# EAGLE design SHIELD TFT (EAGLE 9.6.2)
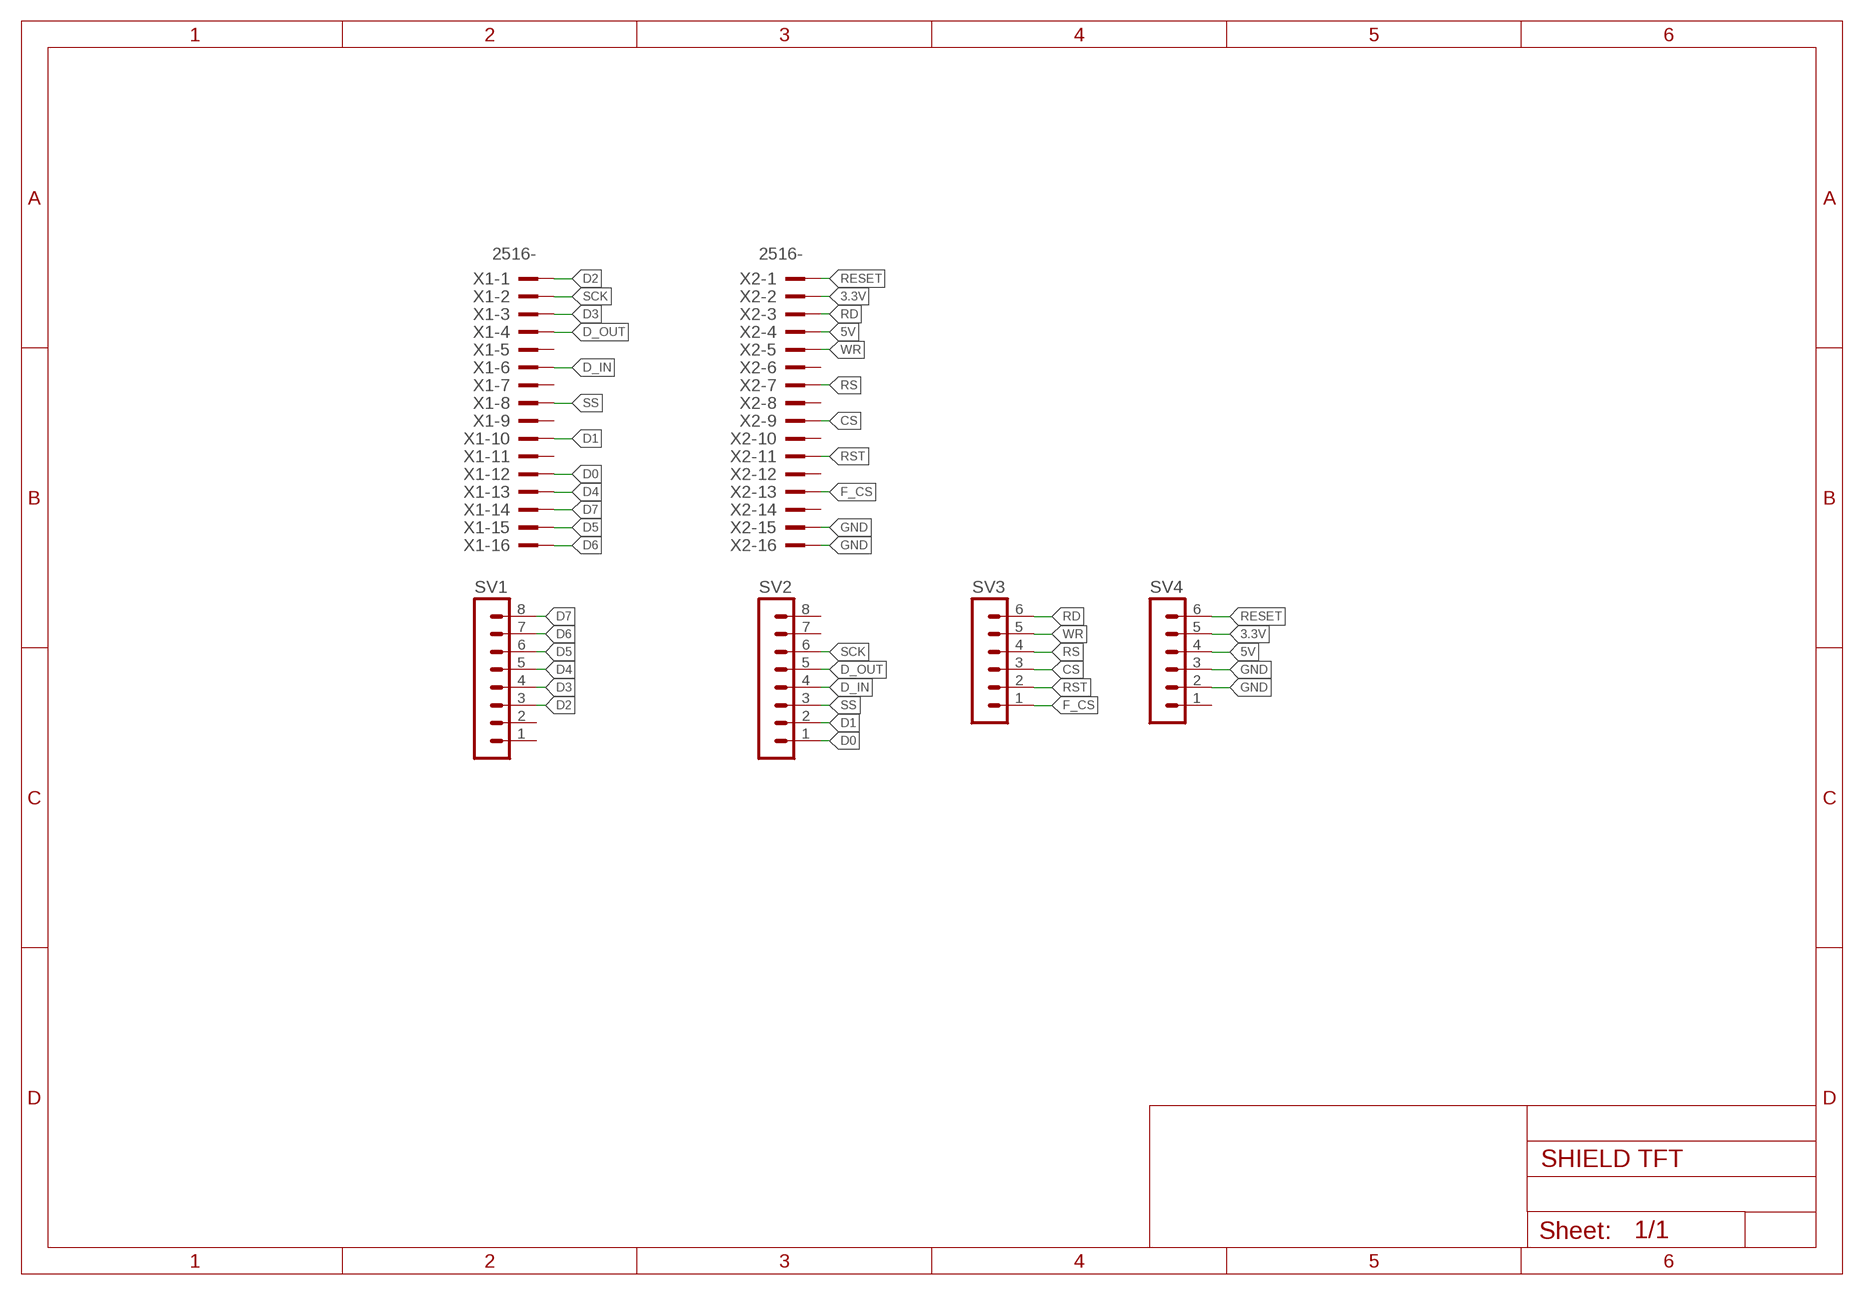
[diagram p0: schematic, sheet 1]

## Parts
SV1  MA08-1  [MA08-1]
SV2  MA08-1  [MA08-1]
SV3  MA06-1  [MA06-1]
SV4  MA06-1  [MA06-1]
X1  2516-  [PAK100/2500-16]
X2  2516-  [PAK100/2500-16]

## Nets
3.3V: SV4.5 X2.2
5V: SV4.4 X2.4
CS: SV3.3 X2.9
D0: SV2.1 X1.12
D1: SV2.2 X1.10
D2: SV1.3 X1.1
D3: SV1.4 X1.3
D4: SV1.5 X1.13
D5: SV1.6 X1.15
D6: SV1.7 X1.16
D7: SV1.8 X1.14
D_IN: SV2.4 X1.6
D_OUT: SV2.5 X1.4
F_CS: SV3.1 X2.13
GND: SV4.2 SV4.3 X2.15 X2.16
RD: SV3.6 X2.3
RESET: SV4.6 X2.1
RS: SV3.4 X2.7
RST: SV3.2 X2.11
SCK: SV2.6 X1.2
SS: SV2.3 X1.8
WR: SV3.5 X2.5
Unconnected: SV1.1 SV1.2 SV2.7 SV2.8 SV4.1 X1.5 X1.7 X1.9 X1.11 X2.6 X2.8 X2.10 X2.12 X2.14

## Library data of the parts
SV1 SV2 = con-lstb:MA08-1: PIN HEADER; OC_FARNELL: unknown; OC_NEWARK: unknown
SV3 SV4 = con-lstb:MA06-1: PIN HEADER; OC_FARNELL: unknown; OC_NEWARK: unknown
X1 X2 = con-3m:2516-: 3M (TM) Pak 100 4-Wall Header Source: 3M; OC_FARNELL: unknown; OC_NEWARK: unknown

## Board
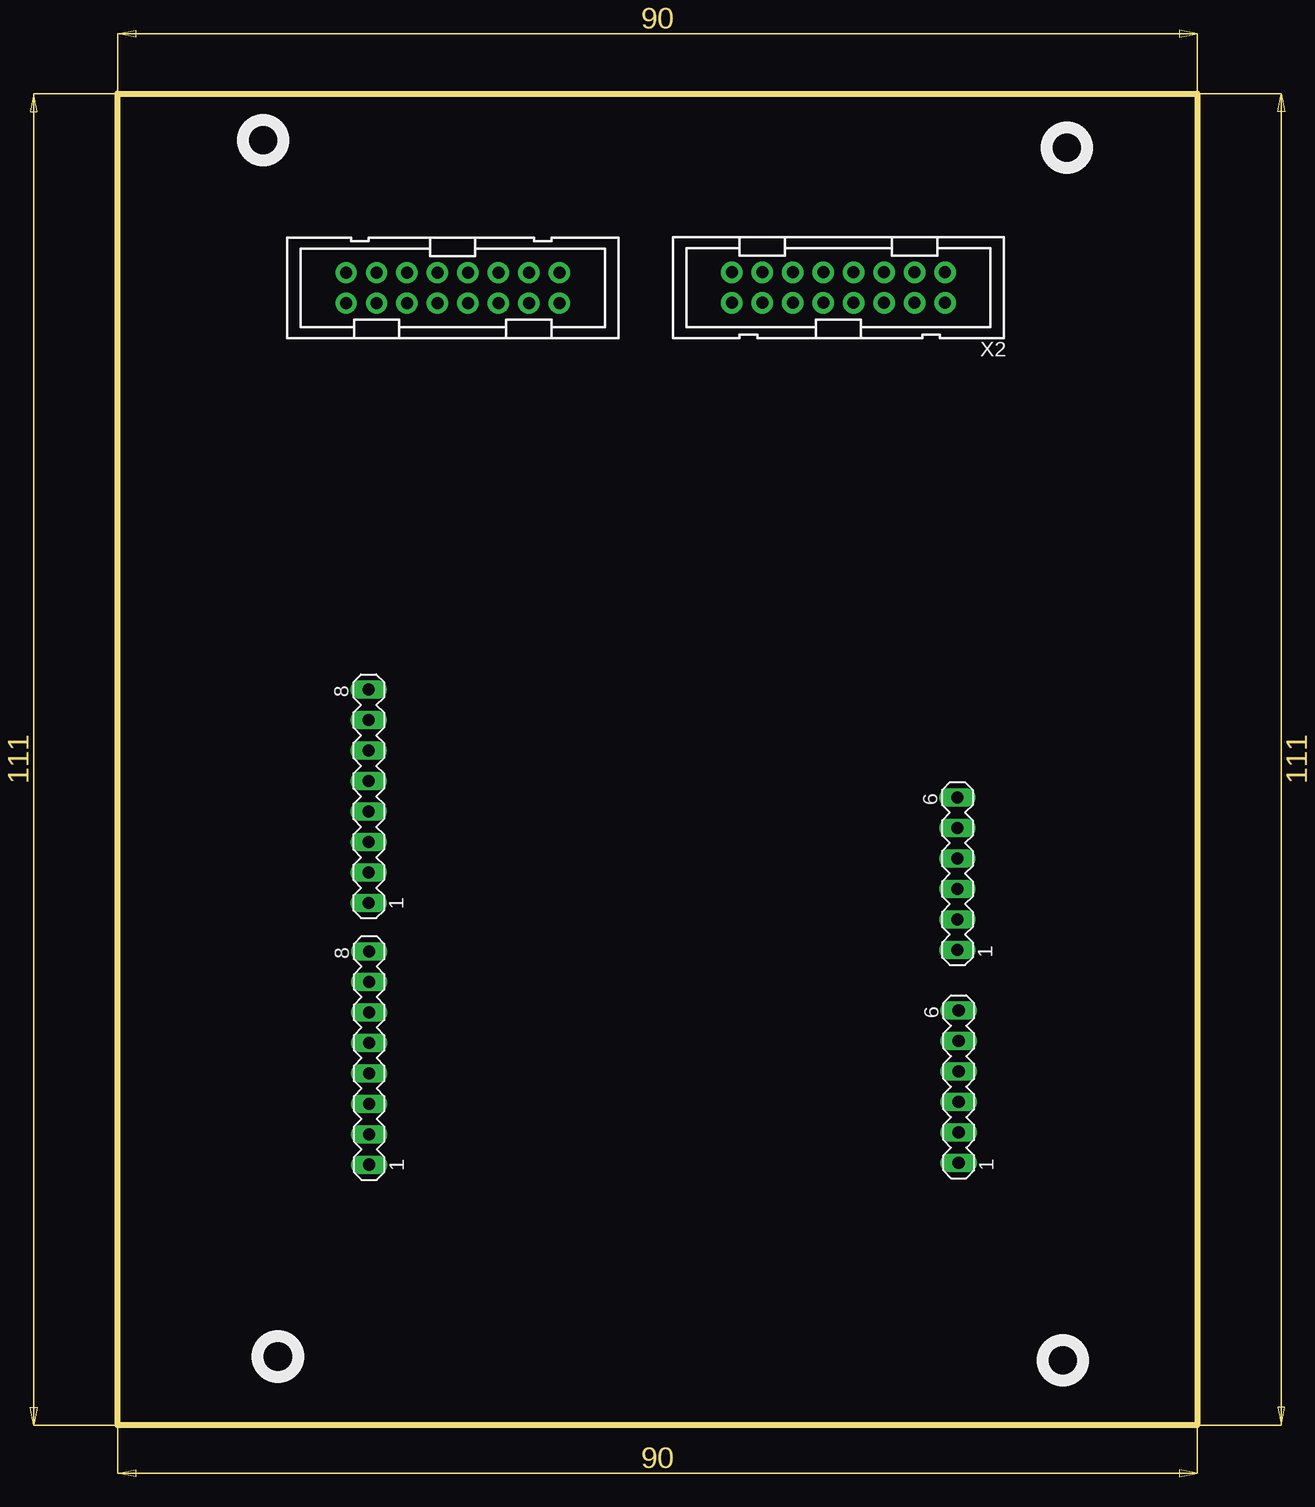
[diagram p1: board, top side]
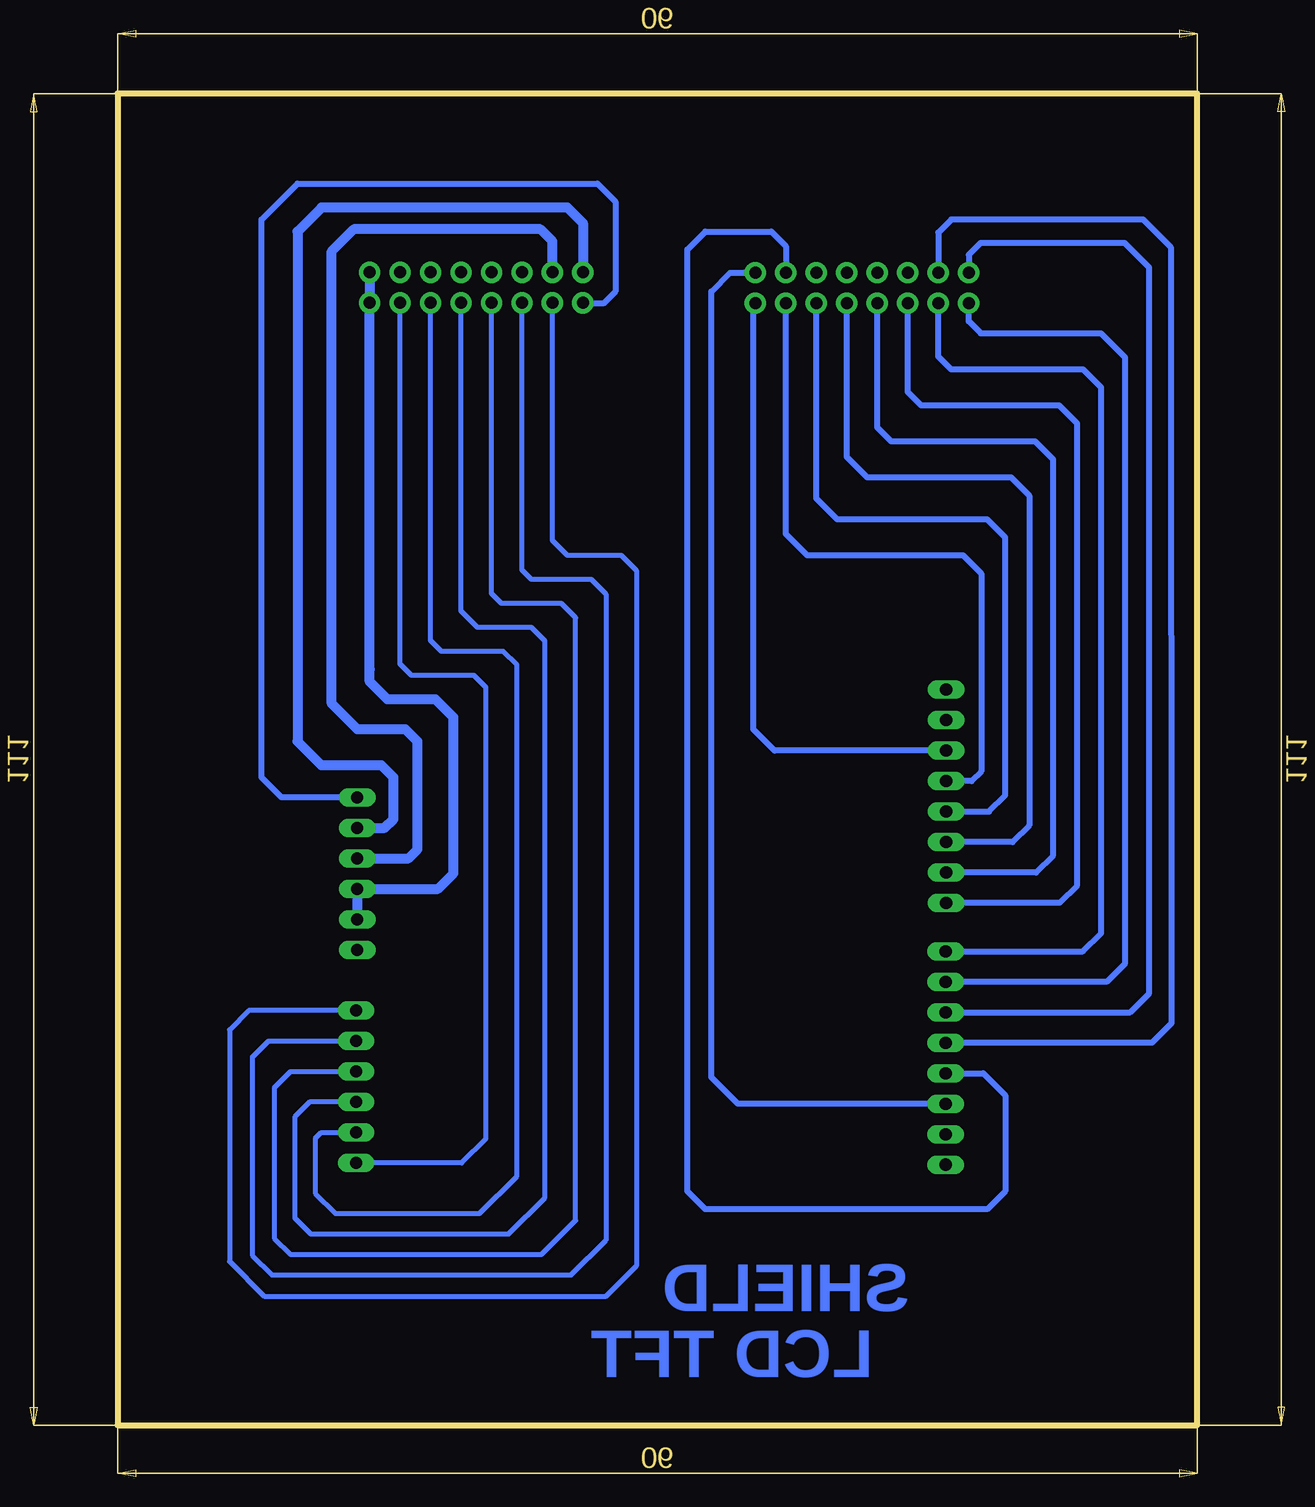
[diagram p2: board, bottom side, seen from below]

Size 90 x 111 mm. Coordinates in mm from the lower left corner, seen from the top.
Outline: 0,111 90,111 90,0 0,0 0,111
Copper layers (1*16): Top 0.035mm / dielectric 1.5mm / Bottom 0.035mm
Design rules "default *": minimum track width 6mil, minimum drill 0.35mm, track to track 12mil, track to pad 12mil, pad to pad 12mil, via to via 24mil, smd to smd 6mil, copper to edge 40mil, drill to drill 6mil, minimum pad ring 10mil, minimum via ring 8mil, stop-mask expansion 4mil, vias tented up to drill 0mil, thermal gap 10mil

### Footprints (pad centres in the part's own frame; a part is rotated, then mirrored left to right if it is on the bottom)
MA08-1 = drill 1.016 long: 1 -8.89,0; 2 -6.35,0; 3 -3.81,0; 4 -1.27,0; 5 1.27,0; 6 3.81,0; 7 6.35,0; 8 8.89,0
MA06-1 = drill 1.016 long: 1 -6.35,0; 2 -3.81,0; 3 -1.27,0; 4 1.27,0; 5 3.81,0; 6 6.35,0
PAK100/2500-16 = drill 1 pad 1.778: 1 -8.89,-1.27; 2 -8.89,1.27; 3 -6.35,-1.27; 4 -6.35,1.27; 5 -3.81,-1.27; 6 -3.81,1.27; 7 -1.27,-1.27; 8 -1.27,1.27; 9 1.27,-1.27; 10 1.27,1.27; 11 3.81,-1.27; 12 3.81,1.27; 13 6.35,-1.27; 14 6.35,1.27; 15 8.89,-1.27; 16 8.89,1.27

### Placement (x,y rotation side)
SV1  20.97,30.6 90 top
SV2  20.93,52.42 90 top
SV3  70.12,28.21 90 top
SV4  70.02,45.97 90 top
X1  27.94,94.8 180 top
X2  60.1,94.83 0 top

### Tracks (layer width: path | path; a pad name or v marks a point on that pad's centre or on a via)
3.3V
  Bottom 0.813: SV4.5 67.72,49.78 67,50.5 67,54 68,55 73,55 75,57 75,99.5 73,101.5 52.5,101.5 51.21,100.21 X2.2
5V
  Bottom 0.813: X2.4 53.75,98.69 54.74,99.68 70.3,99.68 72.14,97.84 72.14,60.14 70,58 66,58 65,57 65,48 65.76,47.24 SV4.4
CS
  Bottom 0.406: X2.9 61.37,67.87 60,66.5 55.5,66.5 54.37,65.37 54.37,18.96 57.39,15.93 73.89,15.93 75.23,17.27 75.23,25.69 73.98,26.94 SV3.3
D0
  Bottom 0.508: X1.12 24.13,86.13 23,85 11.5,85 10,83.5 10,45 11.47,43.53 SV2.1
D1
  Bottom 0.508: X1.10 26.67,83.17 25.5,82 13.5,82 12,80.5 12,47.5 13.43,46.07 SV2.2
D2
  Bottom 0.508: X1.1 38.94,96.06 40.5,94.5 40.5,29 38.29,26.79 SV1.3
D3
  Bottom 0.508: X1.3 34.29,98.29 35.5,99.5 41,99.5 42.5,98 42.5,19.5 41,18 17.5,18 16,19.5 16,27.5 17.83,29.33 SV1.4
D4
  Bottom 0.508: X1.13 21.59,99.41 20.5,100.5 4.5,100.5 2.21,98.21 2.14,33.5 3.77,31.87 SV1.5
D5
  Bottom 0.508: X1.15 19.05,97.56 18.05,98.56 6.06,98.56 4,96.5 4,36 5.59,34.41 SV1.6
D6
  Bottom 0.508: X1.16 19.05,92.03 18.05,91.03 8.03,91.03 6,89 6,38.5 7.55,36.95 SV1.7
D7
  Bottom 0.508: X1.14 21.59,89.09 20.5,88 9.5,88 8,86.5 8,41 9.51,39.49 SV1.8
D_IN
  Bottom 0.508: X1.6 31.75,77.25 30,75.5 17.5,75.5 16,74 16,52.5 17.35,51.15 SV2.4
D_OUT
  Bottom 0.508: X1.4 34.29,74.29 32.5,72.5 19.5,72.5 18,71 18,54.5 18.81,53.69 SV2.5 20.87,53.75
F_CS
  Bottom 0.406: X2.13 66.45,63.45 65.5,62.5 60.29,62.5 59.29,61.5 59.29,23.88 61.31,21.86 SV3.1
GND
  Bottom 0.406: SV4.3 66.8,44.7 | 68.99,62.99 68.99,63
  Bottom 0.813: X2.16 X2.15 68.99,63 68.99,61.99 67.5,60.5 63.5,60.5 62,59 62,46 63.3,44.7 SV4.3 SV4.2
RD
  Bottom 0.406: X2.3 53.75,73.75 52.5,72.5 48,72.5 46.75,71.25 46.75,13.26 49.26,10.75 77.77,10.75 80.67,13.65 80.67,32.96 79.07,34.56 SV3.6
RESET
  Bottom 0.508: SV4.6 76.32,52.32 78,54 78,100.5 75,103.5 50,103.5 48.5,102 48.5,94.5 49.5,93.5 51.15,93.5 X2.1
RS
  Bottom 0.406: X2.7 58.83,69.33 58,68.5 53,68.5 51.82,67.32 51.82,17.06 54.66,14.22 75.57,14.22 76.94,15.59 76.94,28.11 75.57,29.48 SV3.4
RST
  Bottom 0.406: X2.11 63.91,65.41 63,64.5 57.85,64.5 56.72,63.37 56.72,20.75 59.82,17.64 71.84,17.64 73.52,19.32 73.52,23.9 73.01,24.4 SV3.2
SCK
  Bottom 0.508: X1.2 37,93.36 37,58 35.23,56.23 SV2.6
SS
  Bottom 0.508: X1.8 29.21,80.71 27.5,79 15.5,79 14,77.5 14,50 15.39,48.61 SV2.3
WR
  Bottom 0.406: X2.5 56.29,71.29 55.5,70.5 50.5,70.5 49.29,69.29 49.29,15.41 52.18,12.51 77.13,12.51 78.78,14.16 78.78,30.66 77.42,32.02 SV3.5

### Text on the board
Bottom: SHIELD | LCD TFT